# EAGLE design SpectraPCB-V3 (EAGLE 8.0.1)
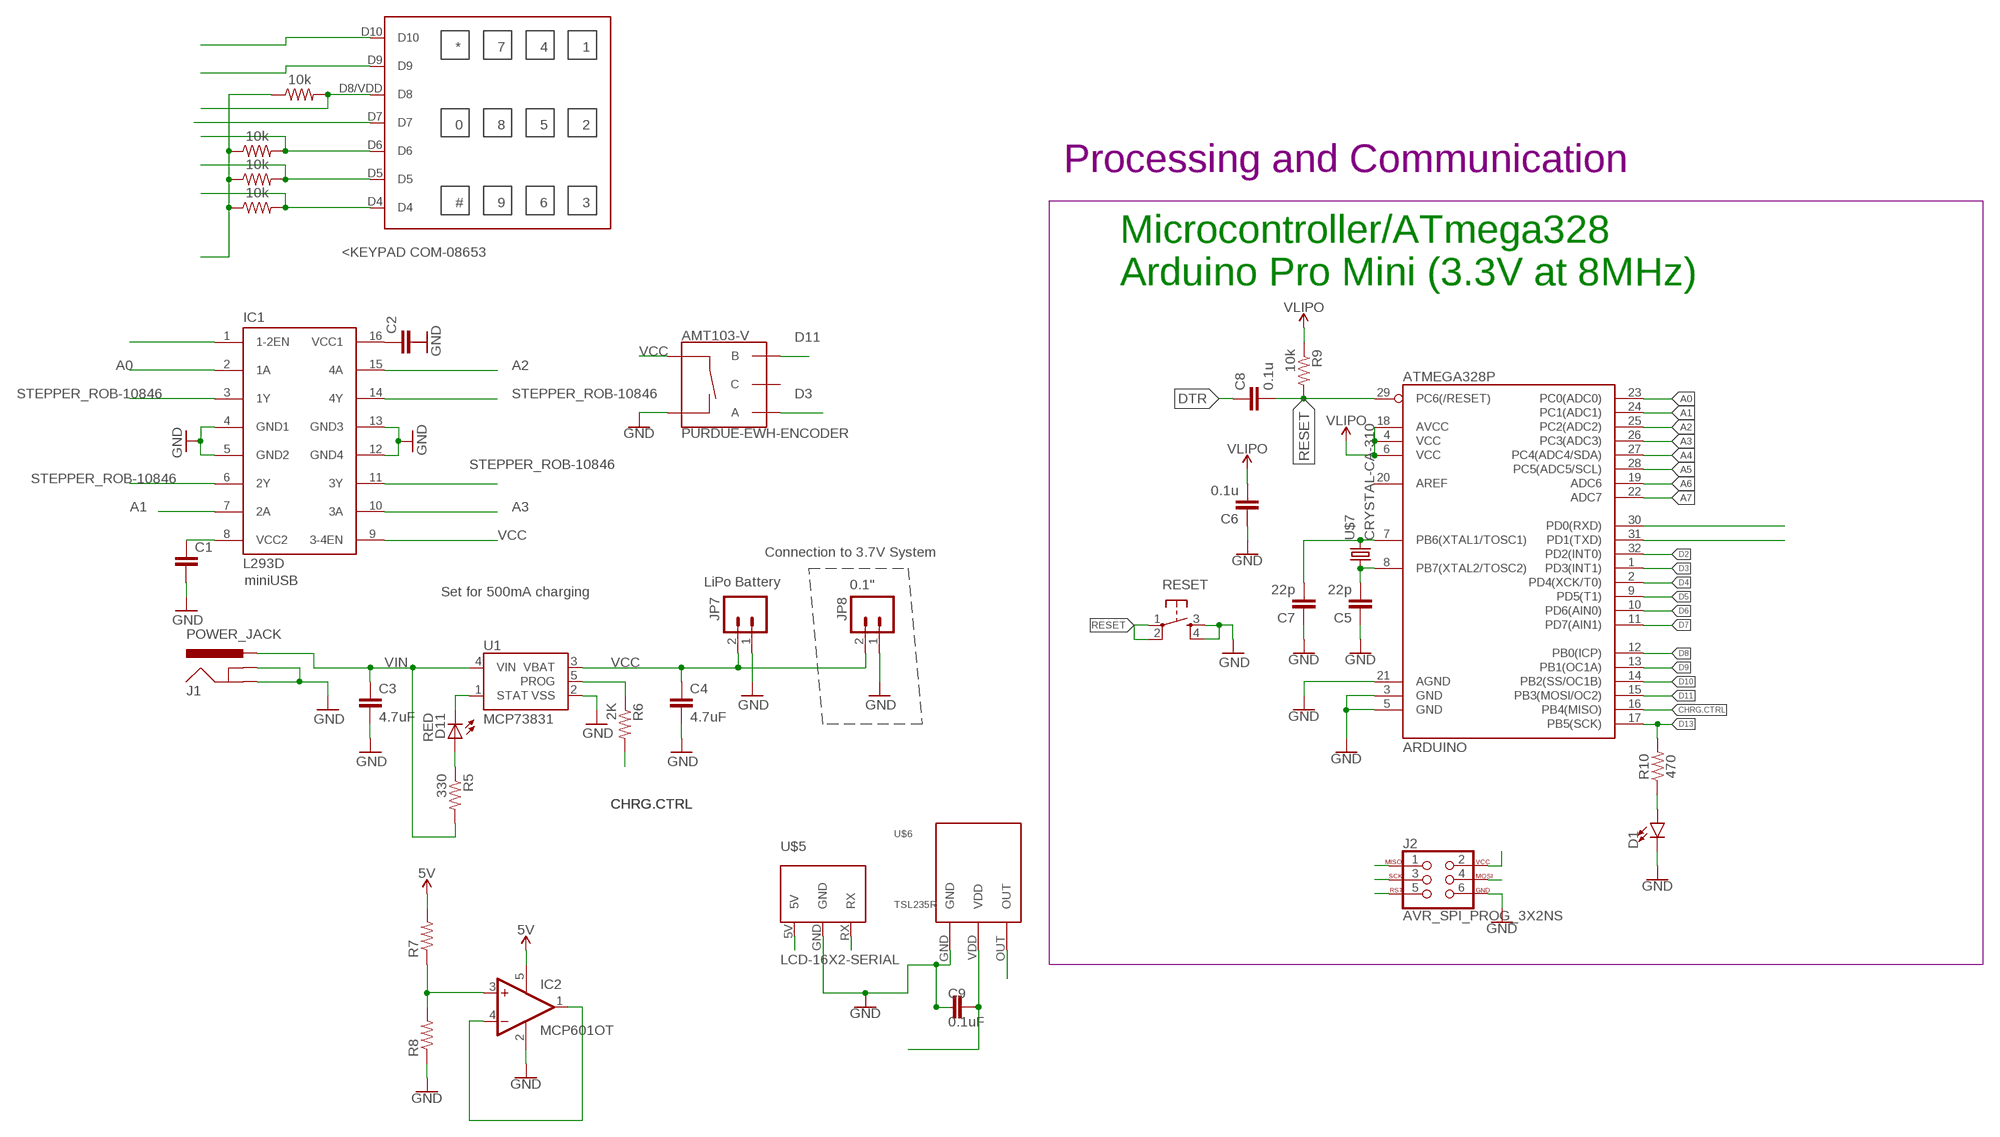
[diagram p0: schematic, sheet 1]

## Parts
AMT103-V  PURDUE-EWH-ENCODER  [PURDUE-EWH-ENCODER]
ARDUINO  ATMEGA328P  ATMEGA328_SMT-OHMOD  [TQFP32-08]
C1  C-EUC0603  [C0603]
C2  C-EUC0402  [C0402]
C3  4.7uF  CAP0402-CAP  [0402-CAP]
C4  4.7uF  CAP0402-CAP  [0402-CAP]
C5  22p  CAPACITOR0402  [C0402]
C6  0.1u  CAPACITOR0402  [C0402]
C7  22p  CAPACITOR0402  [C0402]
C8  0.1u  C-EUC0402  [C0402]
C9  0.1uF  0.1UF-0603-25V-(+80/-20%)  [0603]
D1  LED5MM  [LED_5MM]
D11  RED  LED0603  [LED-0603]
IC1  L293D  [DIL16]
IC2  MCP601OT  [SOT23-5]
J1  POWER_JACK  [POWER_JACK_PTH]
J2  AVR_SPI_PROG_3X2NS  [2X3-NS]
JP7  LiPo Battery  M02-JST-2MM-SMT  [JST-2-SMD]
JP8  M02PTH  [1X02]
R1  10k  10KOHM-0603-1/10W-1%  [0603]
R2  10k  10KOHM-0603-1/10W-1%  [0603]
R3  10k  10KOHM-0603-1/10W-1%  [0603]
R4  10k  10KOHM-0603-1/10W-1%  [0603]
R5  330  RESISTOR0402-RES  [0402-RES]
R6  2K  RESISTOR0402-RES  [0402-RES]
R7  R-US_R0402  [R0402]
R8  R-US_R0402  [R0402]
R9  10k  RESISTOR0402  [R0402]
R10  470  470OHM-0603-1/10W-1%  [0603]
RESET  BUTTON-PTS830GG140  [BUTTON-GULLWING]
U1  MCP73831  [SOT23-5]
U$1  EWH_KEYPAD  [EWH_KEYPAD]
U$5  LCD-16X2-SERIAL  [LCD-16X2-SERIAL]
U$6  TSL235R  [TSL235R]
U$7  CRYSTAL-CA-310  [CA-301]

## Nets
5V: IC2.5(V+) R7.2
A0: ARDUINO.23(PC0(ADC0)) IC1.2(1A)
A1: ARDUINO.24(PC1(ADC1)) IC1.7(2A)
A2: ARDUINO.25(PC2(ADC2)) IC1.15(4A)
A3: ARDUINO.26(PC3(ADC3)) IC1.10(3A)
A4: ARDUINO.27(PC4(ADC4/SDA))
A5: ARDUINO.28(PC5(ADC5/SCL))
A6: ARDUINO.19(ADC6)
A7: ARDUINO.22(ADC7)
CHRG.CTRL: ARDUINO.16(PB4(MISO)) R6.2
D0: ARDUINO.30(PD0(RXD))
D1: ARDUINO.31(PD1(TXD)) U$5.RX
D2: ARDUINO.32(PD2(INT0)) U$6.OUT
D3: AMT103-V.A ARDUINO.1(PD3(INT1))
D4: ARDUINO.2(PD4(XCK/T0)) R4.2 U$1.D4
D5: ARDUINO.9(PD5(T1)) R3.2 U$1.D5
D6: ARDUINO.10(PD6(AIN0)) R2.2 U$1.D6
D7: ARDUINO.11(PD7(AIN1)) U$1.D7
D8: ARDUINO.12(PB0(ICP)) R1.2 U$1.D8/VDD(D8)
D9: ARDUINO.13(PB1(OC1A)) U$1.D9
D10: ARDUINO.14(PB2(SS/OC1B)) U$1.D10
D11: AMT103-V.B ARDUINO.15(PB3(MOSI/OC2))
D13: ARDUINO.17(PB5(SCK)) R10.2
DTR: C8.1
GND: AMT103-V.SW- ARDUINO.3(GND) ARDUINO.5(GND) ARDUINO.21(AGND) C1.2 C3.2 C4.2 C5.1 C6.1 C7.1 C9.1 D1.K(C) IC1.4(GND1) IC1.5(GND2) IC1.12(GND4) IC1.13(GND3) IC2.2(V-) J1.GND J1.GNDBREAK J2.6 JP7.1 JP8.1 R8.1 RESET.3 RESET.4 U1.2(VSS) U$5.GND U$6.GND
N$1: C1.1 IC1.8(VCC2)
N$2: C2.1 IC1.16(VCC1)
N$11: D11.A R5.1
N$12: IC2.3(+IN) R7.1 R8.2
N$13: IC2.1(OUT) IC2.4(-IN)
N$14: ARDUINO.7(PB6(XTAL1/TOSC1)) C7.2 U$7.2
N$15: ARDUINO.8(PB7(XTAL2/TOSC2)) C5.2 U$7.1
N$16: D1.A R10.1
N$17: J2.4
N$18: J2.2
N$24: J2.1
N$25: J2.3
N$26: J2.5
PROG: R6.1 U1.5(PROG)
RESET: ARDUINO.29(PC6(/RESET)) C8.2 R9.2 RESET.1 RESET.2
STAT: D11.C U1.1(STAT)
STEPPER_ROB-10846: IC1.3(1Y) IC1.6(2Y) IC1.11(3Y) IC1.14(4Y)
VCC: AMT103-V.SW+ C4.1 C9.2 IC1.1(1-2EN) IC1.9(3-4EN) JP7.2 JP8.2 U1.3(VBAT) U$5.5V U$6.VDD
VDD: R1.1 R2.1 R3.1 R4.1
VIN: C3.1 J1.PWR R5.2 U1.4(VIN)
VLIPO: ARDUINO.4(VCC) ARDUINO.6(VCC) ARDUINO.18(AVCC) C6.2 R9.1
Unconnected: AMT103-V.C ARDUINO.20(AREF) C2.2

## Notes on the sheet
- * | 7 | 4 | 1
- 0 | 8 | 5 | 2
- Processing and Communication
- # | 9 | 6 | 3
- <KEYPAD COM-08653
- Microcontroller/ATmega328
  Arduino Pro Mini (3.3V at 8MHz)
- Connection to 3.7V System
- miniUSB
- 0.1"
- Set for 500mA charging

## Library data of the parts
AMT103-V = Purdue-EWH-Encoder:PURDUE-EWH-ENCODER: Rotary Encoder w/ Select Switch Encoders rotate similarly to potentiometers, but they’re different from potentiometers in that an encoder has full rotation without limits. They output gray code so that you can tell how much and in which direction the encoder has been turned. This encoder includes a push-down select switch built into the shaft. SparkFun Products Rotary Encoder <https://www.sparkfun.com/products/9117> (COM-09117); SF_SKU: COM-09117
ARDUINO = SparkFun-DigitalIC:ATMEGA328_SMT-OHMOD: 32-Pin Atmega328 part Commonly used on Arduino compatible boards Available in QFP and QFN packages TQFP is IC-09069 QFN is non-stock; PROD_ID: IC-09069
C1 C2 C8 = resistor:C-EU: CAPACITOR, European symbol
C3 C4 = SparkFun:CAP: Capacitor Standard 0603 ceramic capacitor, and 0.1" leaded capacitor.
C5-C7 = CalvEngIO-Passives:CAPACITOR
C9 = SparkFun-Capacitors:0.1UF: 0.1µF ceramic capacitors A capacitor is a passive two-terminal electrical component used to store electrical energy temporarily in an electric field.; PROD_ID: CAP-00810
D1 = SparkFun-LED:LED: LED (Generic) Standard schematic elements and footprints for 5mm, 3mm, 1206, and 0603 sized LEDs. Generic LEDs with no color specified.
D11 = SparkFun:LED: LEDs Standard schematic elements and footprints for 5mm, 3mm, 1206, and 0603 sized LEDs. 5mm - Spark Fun Electronics SKU : COM-00529 (and others)
IC1 = st-microelectronics:L293D: PUSH-PULL 4 CHANNEL DRIVER; MPN: L293D; OC_FARNELL: 9589619; OC_NEWARK: 56P8249
IC2 = CalvEngIO-AnalogIC:MCP601: Single Op Amp 2.7V to 6.0V Single Supply CMOS Source: http://ww1.microchip.com/downloads/en/DeviceDoc/21314g.pdf
J1 = SparkFun-Connectors:POWER_JACK: Power Jack Connector This is the standard 5.5mm barrel jack for power. The PTH is the most common, proven, reliable, footprint. The Slot footprint only works if the mill layer is transmitted to the PCB fab house so be warned. Here are the connectors we sell at SparkFun: DC Barrel Power Jack/Connector <https://www.sparkfun.com/products/119> (PRT-00119) DC Barrel Power Jack/Connector (SMD) <https://www.sparkfun.com/products/12748> (PRT-12748) DC Barrel Jack Adapter - Breadboard Compatible <https://www.sparkfun.com/products/10811> (PRT-10811) It is used on this SparkFun product (and many, many others): SparkFun RedBoard - Programmed with Arduino <https://www.sparkfun.com/products/12757> (DEV-12757) Also, if you need a mating power supply or connector, please check these out: Wall Adapter Power Supply - 9VDC 650mA <https://www.sparkfun.com/products/298> (TOL-00298) DC Barrel Jack Adapter - Male <https://www.sparkfun.com/products/10287> (PRT-10287); PROD_ID: CONN-08197
J2 = CalvEngIO-Connectors:AVR_SPI_PROG_3X2: AVR ISP 6 Pin This is the reduced ISP connector for AVR programming. Common on Arduino. This footprint will take up less PCB space and can be used with a 10-pin to 6-pin adapter such as SKU: BOB-08508 **Special note about "TEST_POINT" package. The stop mask is on the top side, so if you want your programming test points to be on the bottom of your board, make sure to place this package on the bottom side of the board. This also ensure that the orientation to program from the bottom side will be correct. SparkFun Products: SparkFun ISP Pogo Adapter <https://www.sparkfun.com/products/11591> - NS Tiny AVR Programmer <https://www.sparkfun.com/products/11801> -PTH
JP7 JP8 = SparkFun:M02: Header 2 Standard 2-pin 0.1" header. Use with straight break away headers (SKU : PRT-00116), right angle break away headers (PRT-00553), swiss pins (PRT-00743), machine pins (PRT-00117), and female headers (PRT-00115). Molex polarized connector foot print use with SKU : PRT-08233 with associated crimp pins and housings.
R1-R4 = SparkFun-Resistors:10KOHM: 10kΩ resistor A resistor is a passive two-terminal electrical component that implements electrical resistance as a circuit element. Resistors act to reduce current flow, and, at the same time, act to lower voltage levels within circuits. - Wikipedia; PROD_ID: RES-00824
R5 R6 = SparkFun:RESISTOR: Resistor Basic schematic elements and footprints for 0603, 1206, and PTH resistors.
R7 R8 = resistor:R-US_: RESISTOR, American symbol
R9 = CalvEngIO-Passives:RESISTOR
R10 = SparkFun-Resistors:470OHM: 470Ω resistor A resistor is a passive two-terminal electrical component that implements electrical resistance as a circuit element. Resistors act to reduce current flow, and, at the same time, act to lower voltage levels within circuits. - Wikipedia; PROD_ID: RES-07869
RESET = Orlando:BUTTON-PTS830GG140
U1 = SparkFun:MCP73831: Microchip's MCP73831 Miniature single cell, fully integrated Li-Ion, Li-polymer charge management controller http://ww1.microchip.com/downloads/en/DeviceDoc/21984a.pdf
U$1 = Purdue-EWH-Keypad:EWH_KEYPAD
U$5 = Purdue-EWH-Displays:LCD-16X2-SERIAL
U$6 = Purdue-EWH-Sensors:TSL235R
U$7 = OrlandoRonMod:CRYSTAL-CA-310

## Net classes
0 default: width 0.203 mm

## Board
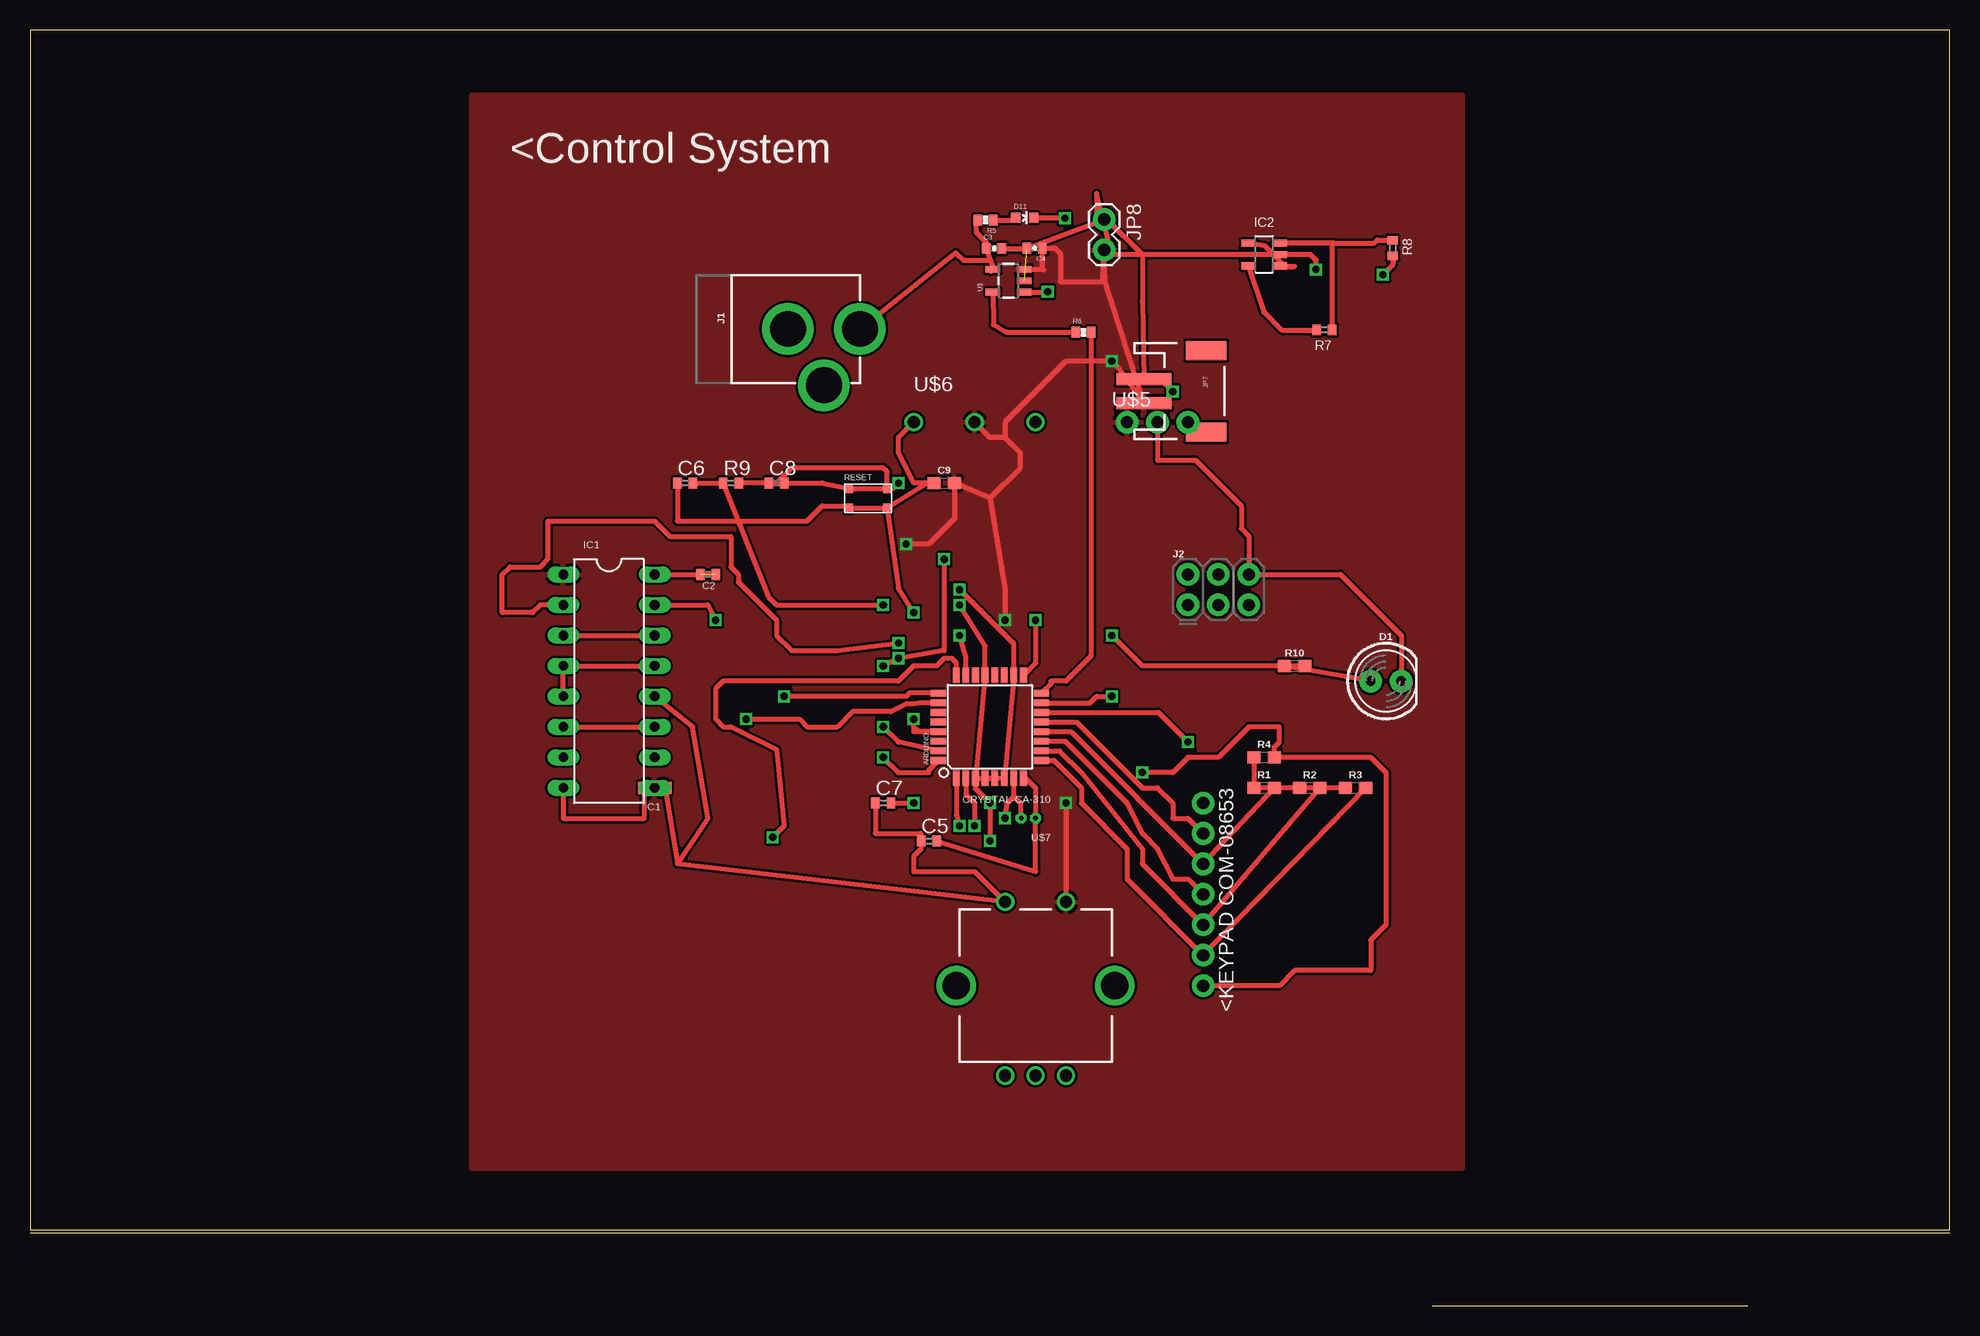
[diagram p1: board, top side]
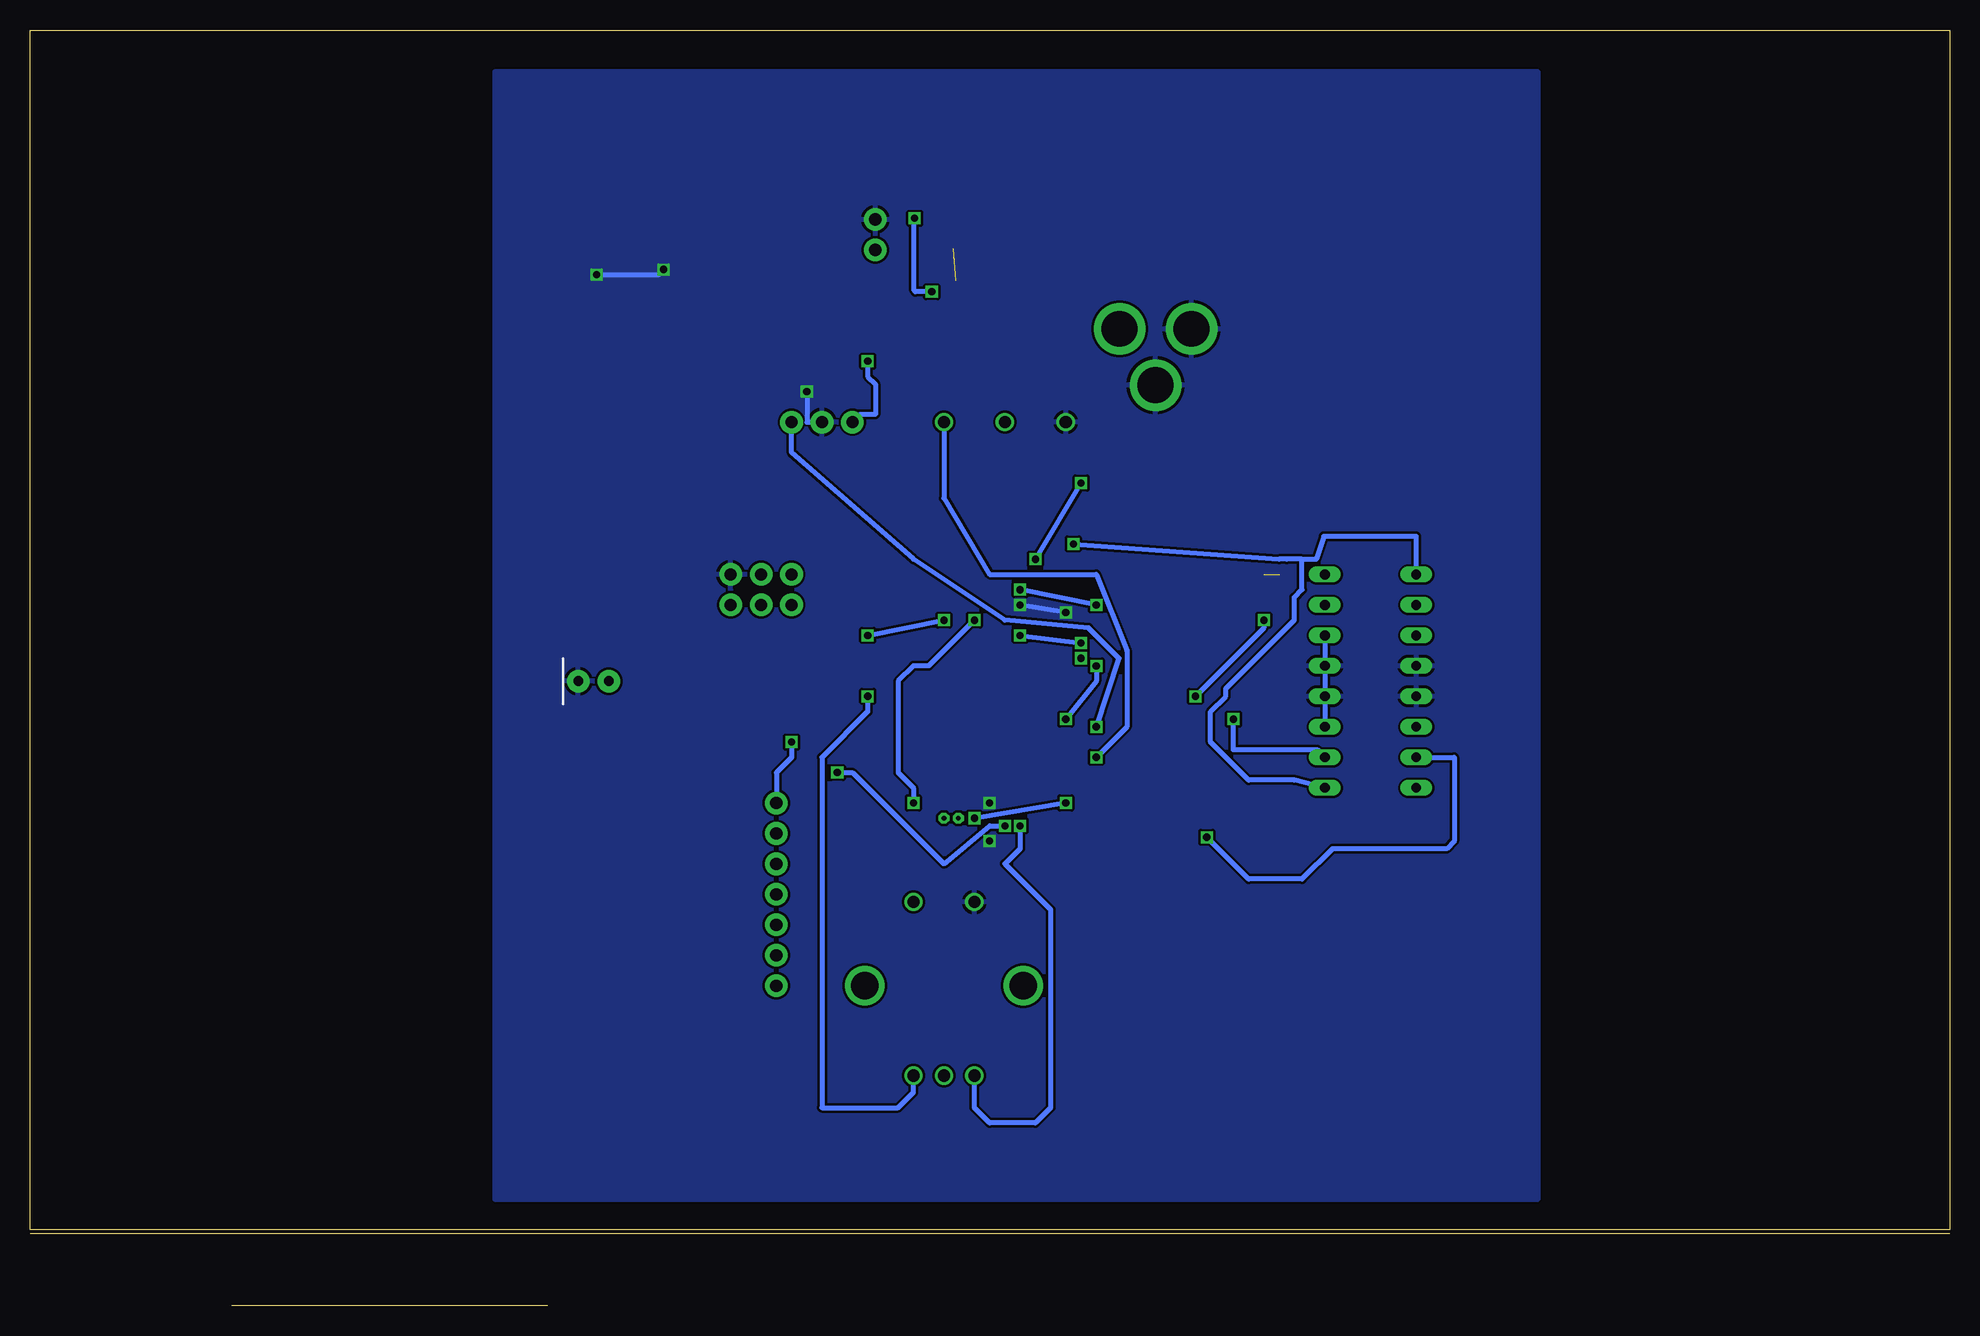
[diagram p2: board, bottom side, seen from below]

Size 160 x 106.35 mm. Coordinates in mm from the lower left corner, seen from the top.
Outline: 160,6.02 0,6.02
Outline: 116.84,0 143.18,0
Outline: 0,6.35 160,6.35 160,106.35 0,106.35 0,6.35
Copper layers (1*16): Top 0.035mm / dielectric 1.5mm / Bottom 0.035mm
Design rules "default": minimum track width 10mil, minimum drill 24mil, track to track 8mil, track to pad 8mil, pad to pad 8mil, via to via 8mil, smd to smd 8mil, copper to edge 40mil, drill to drill 8mil, minimum pad ring 10mil, minimum via ring 8mil, stop-mask expansion 4mil, vias tented up to drill 0mil, thermal gap 10mil

### Footprints (pad centres in the part's own frame; a part is rotated, then mirrored left to right if it is on the bottom)
PURDUE-EWH-ENCODER = drill 1.016: A 7.493,-2.54; B 7.493,2.54; C 7.493,0; SW+ -6.985,2.54; SW- -6.985,-2.54 | drill 2.286: P$3 0,6.604; P$4 0,-6.604
TQFP32-08 = smd 1.27 x 0.559: 1 -4.293,2.8; 2 -4.293,2; 3 -4.293,1.2; 4 -4.293,0.4; 5 -4.293,-0.4; 6 -4.293,-1.2; 7 -4.293,-2; 8 -4.293,-2.8; 17 4.293,-2.8; 18 4.293,-2; 19 4.293,-1.2; 20 4.293,-0.4; 21 4.293,0.4; 22 4.293,1.2; 23 4.293,2; 24 4.293,2.8 | smd 0.559 x 1.27: 9 -2.8,-4.293; 10 -2,-4.293; 11 -1.2,-4.293; 12 -0.4,-4.293; 13 0.4,-4.293; 14 1.2,-4.293; 15 2,-4.293; 16 2.8,-4.293; 25 2.8,4.293; 26 2,4.293; 27 1.2,4.293; 28 0.4,4.293; 29 -0.4,4.293; 30 -1.2,4.293; 31 -2,4.293; 32 -2.8,4.293
C0603 = smd 1.1 x 1: 1 -0.85,0; 2 0.85,0
C0402 = smd 0.7 x 0.9: 1 -0.65,0; 2 0.65,0
0402-CAP = smd 0.7 x 0.9: 1 -0.65,0; 2 0.65,0
0603 = smd 1.1 x 1: 1 -0.85,0; 2 0.85,0
LED_5MM = drill 0.813 pad 1.88: A -1.27,0; K 1.27,0
LED-0603 = smd 0.8 x 0.8: A 0,-0.75; C 0,0.75
DIL16 = drill 0.813 long: 1 -8.89,-3.81; 2 -6.35,-3.81; 3 -3.81,-3.81; 4 -1.27,-3.81; 5 1.27,-3.81; 6 3.81,-3.81; 7 6.35,-3.81; 8 8.89,-3.81; 9 8.89,3.81; 10 6.35,3.81; 11 3.81,3.81; 12 1.27,3.81; 13 -1.27,3.81; 14 -3.81,3.81; 15 -6.35,3.81; 16 -8.89,3.81
SOT23-5 = smd 0.6 x 1.2: 1 -0.95,-1.306; 2 0,-1.306; 3 0.95,-1.306; 4 0.95,1.306; 5 -0.95,1.306
POWER_JACK_PTH = drill 2.997 pad 4.318: GND 0,7.7; GNDBREAK 4.7,10.7; PWR 0,13.7
2X3-NS = drill 1.016 pad 1.88: 1 -2.54,-1.27; 2 -2.54,1.27; 3 0,-1.27; 4 0,1.27; 5 2.54,-1.27; 6 2.54,1.27
JST-2-SMD = smd 1 x 4.6: 1 -1,-3.7; 2 1,-3.7 | smd 1.6 x 3.4: NC1 -3.4,1.5; NC2 3.4,1.5
1X02 = drill 1.016 pad 1.88: 1 0,0; 2 2.54,0
0402-RES = smd 0.7 x 0.9: 1 -0.65,0; 2 0.65,0
R0402 = smd 0.7 x 0.9: 1 -0.65,0; 2 0.65,0
BUTTON-GULLWING = smd 0.7 x 0.75: 1 -1.6,0.825; 2 1.6,0.825; 3 -1.6,-0.825; 4 1.6,-0.825
SOT23-5' = smd 0.55 x 1.2: 1 -0.95,-1.3; 2 0,-1.3; 3 0.95,-1.3; 4 0.95,1.3; 5 -0.95,1.3
EWH_KEYPAD = drill 1.016 pad 1.88: D4 7.62,0; D5 5.08,0; D6 2.54,0; D7 0,0; D8/VDD -2.54,0; D9 -5.08,0; D10 -7.62,0
LCD-16X2-SERIAL = drill 1.016 pad 1.88: 5V -2.54,0; GND 0,0; RX 2.54,0
TSL235R = drill 1.016: GND -5.08,-10.16; OUT 5.08,-10.16; VDD 0,-10.16
CA-301 = drill 0.4 octagon: 1 0,0; 2 1.2,0

### Placement (x,y rotation side)
AMT103-V  83.82,26.67 270 top
ARDUINO  80.01,48.26 90 top
C1  52.07,43.18 0 top
C2  56.52,60.96 0 top
C3  80.37,88.14 0 top
C4  83.74,88.16 180 top
C5  74.93,38.73 0 top
C6  54.61,68.58 0 top
C7  71.12,41.91 0 top
C8  62.23,68.58 0 top
C9  76.2,68.58 0 top
D1  113.03,52.07 0 top
D11  82.91,90.7 270 top
IC1  48.26,52.07 270 top
IC2  102.87,87.63 90 top
J1  55.47,81.43 270 top
J2  99.06,59.69 0 top
JP7  96.55,76.23 270 top
JP8  89.53,90.55 270 top
R1  102.87,43.18 0 top
R2  106.68,43.18 0 top
R3  110.49,43.18 0 top
R4  102.87,45.72 0 top
R5  79.65,90.5 180 top
R6  87.81,81.15 0 top
R7  107.9,81.36 180 top
R8  113.59,88.16 90 top
R9  58.42,68.58 0 top
R10  105.41,53.34 0 top
RESET  69.85,67.31 0 top
U1  MCP73831  [SOT23-5']  81.56,85.45 90 top
U$1  97.79,34.29 270 top
U$5  93.98,73.66 0 top
U$6  78.74,83.82 0 top
U$7  83.82,40.64 180 top

### Tracks (layer width: path | path; a pad name or v marks a point on that pad's centre or on a via)
5V
  Top 0.406: IC2.5 102.83,82.81 104.32,81.33 107.22,81.33 R7.2
A0  (via drill 0.6)
  Top 0.406: ARDUINO.23 78.01,54.07 v77.47,55.88 | v72.39,55.25 67.31,54.61 63.5,54.61 62.23,55.88 62.23,57.15 59.05,60.33 59.05,60.96 58.42,61.59 58.42,64.13 53.34,64.13 52.07,65.41 43.18,65.41 43.18,62.23 42.55,61.59 40.01,61.59 39.37,60.96 39.37,57.79 41.91,57.79 42.55,58.42 IC1.2
  Bottom 0.406: v77.47,55.88 v72.39,55.25
A1  (via drill 0.6)
  Top 0.406: ARDUINO.24 77.21,53.6 76.83,53.98 76.2,53.98 75.56,53.34 73.66,53.34 72.39,52.07 57.78,52.07 57.15,51.44 57.15,48.9 57.78,48.26 58.42,48.26 62.23,46.36 62.87,40.01 v61.91,39.05
  Bottom 0.406: IC1.7 41.27,45.72 41.27,38.73 41.91,38.1 51.44,38.1 53.98,35.56 58.42,35.56 v61.91,39.05
A2  (via drill 0.6)
  Top 0.406: ARDUINO.25 73.28,51.06 73.03,50.8 v62.87,50.8 | v57.15,57.15 56.52,58.42 IC1.15
  Bottom 0.406: v57.15,57.15 57.15,56.52 v62.87,50.8
A3  (via drill 0.6)
  Top 0.406: ARDUINO.26 74.2,50.26 73.66,50.16 73.03,50.16 71.75,49.53 68.58,49.53 67.31,48.26 64.77,48.26 64.14,48.9 v59.69,48.9
  Bottom 0.406: v59.69,48.9 59.69,46.36 56.52,46.36 52.7,46.36 IC1.10
CHRG.CTRL
  Top 0.406: R6.2 88.46,54.17 86.36,52.07 85.09,52.07 85.09,51.85 ARDUINO.16
D1  (via drill 0.6)
  Top 0.406: ARDUINO.31 72.39,46.99 v71.12,48.26
  Bottom 0.406: v71.12,48.26 69.22,53.98 71.75,56.52 78.74,57.15 86.36,62.23 96.52,71.12 U$5.RX
D2  (via drill 0.6)
  Top 0.406: v71.12,45.72 72.39,44.45 74.93,44.45 74.93,44.67 ARDUINO.32
  Bottom 0.406: U$6.OUT 83.82,67.31 80.01,60.96 71.12,60.96 68.58,54.61 68.58,48.26 v71.12,45.72
D3  (via drill 0.6)
  Top 0.406: ARDUINO.1 77.21,40.9 v77.47,40.01
  Bottom 0.406: v77.47,40.01 77.47,38.1 78.74,36.83 74.93,33.02 74.93,16.51 76.2,15.24 80.01,15.24 81.28,16.51 AMT103-V.A
D4  (via drill 0.6)
  Top 0.406: U$1.D4 104.14,26.67 105.41,27.94 111.76,27.94 111.76,30.48 113.03,31.75 113.03,44.45 111.76,45.72 R4.2 103.72,46.57 104.14,46.99 104.14,48.26 101.6,48.26 99.06,45.72 96.52,45.72 95.25,44.45 v92.71,44.45 | ARDUINO.2 78.01,42.64 78.74,41.91 v78.74,40.01
  Bottom 0.406: v92.71,44.45 91.44,44.45 83.82,36.83 80.01,40.01 v78.74,40.01
D5
  Top 0.406: R3.2 U$1.D5 91.44,35.56 91.44,38.1 87.63,41.91 87.63,43.18 85.35,45.46 ARDUINO.9
D6
  Top 0.406: R2.2 U$1.D6 92.71,36.83 92.71,38.1 87.63,44.45 85.82,46.26 ARDUINO.10
D7
  Top 0.406: ARDUINO.11 86.29,47.06 91.44,41.91 92.71,39.37 93.98,38.1 95.25,35.56 96.52,35.56 U$1.D7
D8
  Top 0.406: R1.2 U$1.D8/VDD 86.76,47.86 ARDUINO.12
D9
  Top 0.406: ARDUINO.13 87.23,48.66 92.71,43.18 93.98,43.18 95.25,41.91 95.25,40.64 96.52,40.64 U$1.D9
D10  (via drill 0.6)
  Top 0.406: ARDUINO.14 94.05,49.46 v96.52,46.99
  Bottom 0.406: v96.52,46.99 96.52,45.72 97.79,44.45 U$1.D10
D11  (via drill 0.6)
  Top 0.406: ARDUINO.15 88.36,50.26 88.9,50.8 v90.17,50.8
  Bottom 0.406: v90.17,50.8 90.17,49.53 93.98,45.72 93.98,16.51 87.63,16.51 86.36,17.78 AMT103-V.B
D13  (via drill 0.6)
  Top 0.406: R10.2 92.71,53.34 v90.17,55.88 | v83.82,57.15 83.82,55.88 | 83.82,55.88 83.82,54.61 | 83.82,55.88 83.82,54.61 | 83.82,54.61 83.82,53.56 ARDUINO.17
  Bottom 0.406: v90.17,55.88 v83.82,57.15
GND  (via drill 0.6)  (1 unrouted)
  Top 0.406: IC1.5 IC1.4 IC1.13 | C1.2 53.98,36.83 | 53.98,36.83 56.52,40.64 55.24,48.26 IC1.12 | C3.2 83.07,88.14 | 83.07,88.14 C4.2 | R8.1 113.59,86.77 v112.78,85.95 | v107.19,86.38 107.19,87.17 106.73,87.63 IC2.2 90.17,87.63 88.9,92.71 88.9,91.19 JP8.1 | 53.98,36.83 AMT103-V.SW- 78.74,36.2 73.66,36.2 73.66,37.46 74.28,38.09 C5.1 74.27,39.38 70.47,39.38 | 83.07,88.14 JP8.1 | ARDUINO.3 ARDUINO.21 79.61,55.01 v77.47,58.42 | v73.66,57.79 72.39,59.8 RESET.4 | RESET.4 RESET.3 68.06,66.67 66.04,66.67 64.77,65.41 53.98,65.41 53.96,65.42 C6.1 | RESET.4 74.81,68.58 C9.1 73.66,68.58 72.39,71.12 72.39,72.39 U$6.GND | JP8.1 89.79,90.55 92.71,87.63 92.71,83.71 JP7.1 94.22,77.22 v95.25,76.2 | U$5.GND 93.98,70.48 97.16,70.48 100.97,66.67 100.97,64.77 101.6,64.13 J2.6 109.22,60.96 114.3,55.88 D1.K | C7.1 70.47,39.38 | 70.47,39.38 70.48,39.37 | ARDUINO.3 ARDUINO.5 | ARDUINO.3 78.81,43.11 v80.01,41.91 v80.01,38.73
  Bottom 0.406: v112.78,85.95 107.62,85.95 v107.19,86.38 | U$5.GND 95.25,73.66 v95.25,76.2 | v73.66,57.79 v77.47,58.42
  pour Bottom: 34.92,102.87 121.28,102.87 121.28,8.89 34.29,8.89 34.29,11.43 34.29,102.87
N$1
  Top 0.406: IC1.8 44.45,40.64 51.22,40.64 C1.1
N$2  (1 unrouted)
  Top 0.406: IC1.16 57.15,60.96
N$11
  Top 0.406: R5.1 81.95,90.5 D11.A
N$12
  Top 0.406: 108.66,88.58 IC2.3 | 108.66,88.58 112.02,88.58 112.29,88.85 113.55,88.85 R8.2 | R7.1 108.55,88.47 108.66,88.58
N$13
  Top 0.406: IC2.4 102.83,88.4 104.6,86.64 105.41,86.64 IC2.1
N$14  (via drill 0.6)
  Top 0.406: 82.01,42.45 ARDUINO.7 | 82.01,42.45 82.55,41.91 82.55,40.71 U$7.2 | C7.2 v73.66,41.91 | v81.28,40.64 81.47,41.91 82.01,42.45
  Bottom 0.406: v73.66,41.91 v81.28,40.64
N$15
  Top 0.406: ARDUINO.8 83.03,43.97 83.82,43.18 U$7.1 83.82,36.2 C5.2
N$16
  Top 0.406: D1.A R10.1
PROG
  Top 0.406: U1.5 80.31,81.78 81.36,81.18 R6.1
RESET  (via drill 0.6)
  Top 0.406: C8.2 66.04,68.58 RESET.1 RESET.2 | R9.2 62.23,68.58 63.5,69.85 71.12,69.85 71.45,69.52 RESET.2 | RESET.2 71.94,68.13 v72.39,68.58 | v76.2,62.23 76.2,54.61 v72.39,53.98 v71.12,53.34 | 73.66,48.26 v73.66,48.9 | 73.66,48.26 73.66,47.86 ARDUINO.29 74.06,47.86 73.66,48.26
  Bottom 0.406: v72.39,68.58 v76.2,62.23 | v71.12,53.34 71.12,52.07 v73.66,48.9
STAT  (via drill 0.6)
  Top 0.406: 83.1,84.51 U1.1 84.72,84.5 84.78,84.43 84.78,84.48 v84.84,84.53 | v86.26,90.65 83.71,90.65 D11.C
  Bottom 0.406: v84.84,84.53 86.21,84.53 86.31,84.63 86.31,90.6 v86.26,90.65 86.18,90.73
STEPPER_ROB-10846
  Top 0.406: IC1.3 IC1.14 | IC1.6 IC1.11
  Bottom 0.406: IC1.14 IC1.11
VCC  (via drill 0.6)
  Top 0.406: U1.3 82.89,86.36 84.51,86.36 84.39,86.47 C4.1 85.42,88.16 85.88,87.71 85.88,85.39 85.9,85.37 89.43,85.37 JP8.2 | JP8.2 89.48,85.52 | JP8.2 89.62,85.38 JP7.2 90.17,78.9 v90.17,78.74 86.36,78.74 81.28,73.66 81.28,72.39 | 80.01,67.31 82.55,69.85 82.55,71.12 81.28,72.39 | 81.28,72.39 80.01,72.39 U$6.VDD | 80.01,67.31 C9.2 77.05,65.62 74.93,63.5 v73.03,63.5 | 80.01,67.31 81.28,59.69 v81.28,57.15 | v86.36,41.91 AMT103-V.SW+
  Bottom 0.406: v81.28,57.15 85.09,53.34 86.36,53.34 87.63,52.07 87.63,44.45 86.36,43.18 v86.36,41.91 | v90.17,78.74 90.17,77.47 89.53,76.83 89.53,74.29 90.81,74.29 U$5.5V | v73.03,63.5 55.88,62.23 | 55.24,62.23 55.88,62.23 | 53.98,62.24 52.79,62.24 52.16,64.13 44.45,64.13 IC1.1 | 53.98,62.24 55.88,62.23 | IC1.9 54.61,43.82 58.42,43.82 61.59,46.99 61.59,49.53 60.33,50.8 60.33,51.44 54.61,57.15 54.61,59.05 53.98,59.69 53.98,62.23 53.98,62.24
  pour Top: 37.47,100.96 119.38,100.96 119.38,11.43 36.83,11.43 36.83,100.96
VDD
  Top 0.406: R4.1 R1.1 R2.1 R3.1
VIN
  Top 0.406: 80.07,86.21 U1.4 80.26,86.55 80.05,87.17 | 80.05,87.17 C3.1 79.72,88.64 78.89,89.46 78.89,90.39 R5.2 | J1.PWR 77.17,87.78 77.8,87.15 80.02,87.15 80.05,87.17
VLIPO  (via drill 0.6)
  Top 0.406: C6.2 R9.1 61.58,59.07 62.23,58.42 v71.12,58.42 | v77.47,59.69 82.01,55.15 ARDUINO.18 ARDUINO.6 ARDUINO.4
  Bottom 0.406: v71.12,58.42 v77.47,59.69

### Text on the board
tNames: <Control System